# EAGLE design simpleSensor.-.v1.3 (EAGLE 5.11)
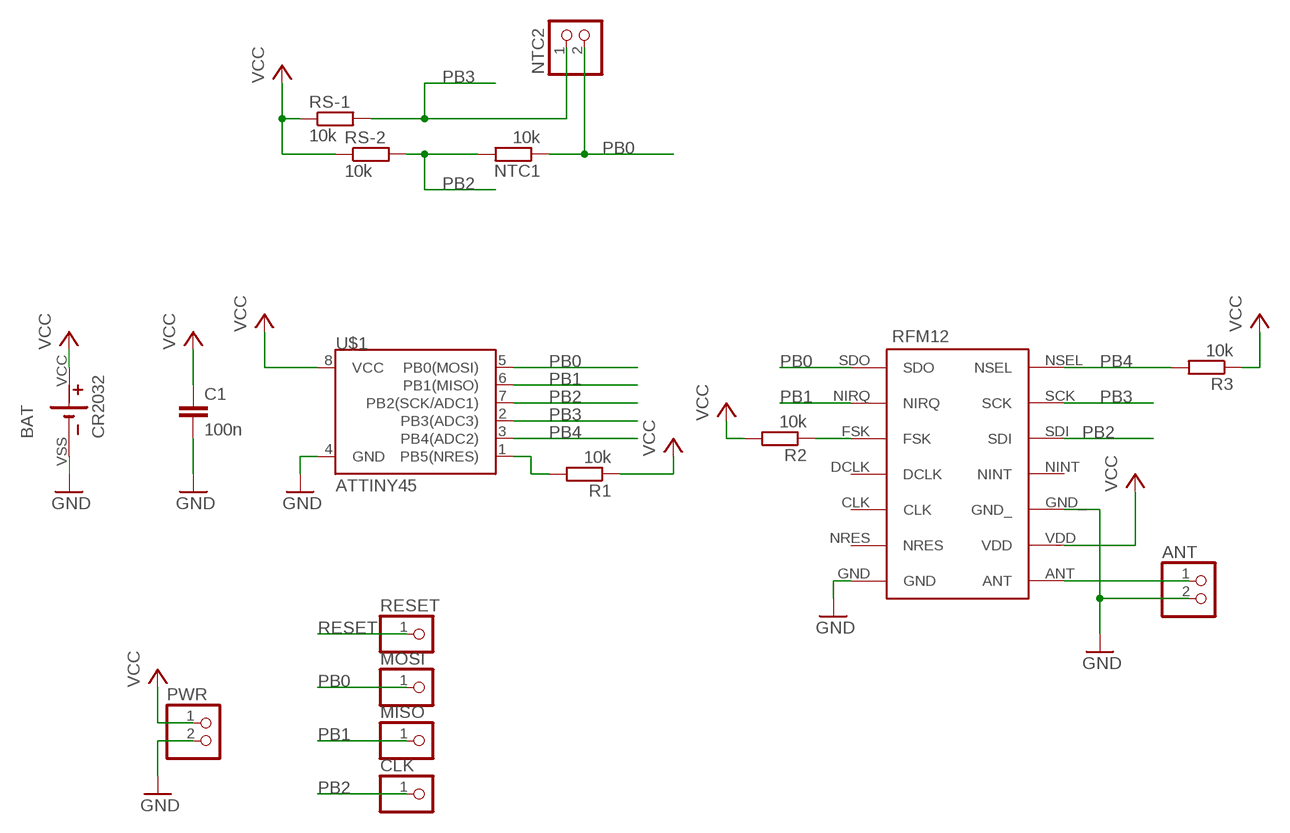
[diagram p0: schematic, sheet 1]

## Parts
ANT  PINHD-1X2  [1X02]
BAT  CR2032  BATTERYHOLDERCR2032_HORIZONTAL  [BATTERY_2032_HOR]
C1  100n  C-EUC0805  [C0805]
CLK  PINHD-1X1  [1X01]
MISO  PINHD-1X1  [1X01]
MOSI  PINHD-1X1  [1X01]
NTC1  10k  R-EU_R0805  [R0805]
NTC2  PINHD-1X2  [1X02]
PWR  PINHD-1X2  [1X02]
R1  10k  R-EU_R0805  [R0805]
R2  10k  R-EU_R0805  [R0805]
R3  10k  R-EU_R0805  [R0805]
RESET  PINHD-1X1  [1X01]
RFM12  RFM12SMD  [RFM_SMD]
RS-1  10k  R-EU_R0805  [R0805]
RS-2  10k  R-EU_R0805  [R0805]
U$1  ATTINY45  [SO08-EIAJ]

## Nets
ANT: ANT.1 RFM12.ANT
GND: ANT.2 BAT.VSS C1.2 PWR.2 RFM12.GND RFM12.GND_ U$1.4(GND)
N$4: R2.1 RFM12.FSK
PB0: MOSI.1 NTC1.1 NTC2.2 RFM12.SDO U$1.5(PB0(MOSI))
PB1: MISO.1 RFM12.NIRQ U$1.6(PB1(MISO))
PB2: CLK.1 NTC1.2 RFM12.SDI RS-2.2 U$1.7(PB2(SCK/ADC1))
PB3: NTC2.1 RFM12.SCK RS-1.2 U$1.2(PB3(ADC3))
PB4: R3.2 RFM12.NSEL U$1.3(PB4(ADC2))
RESET: R1.2 RESET.1 U$1.1(PB5(NRES))
VCC: BAT.VCC C1.1 PWR.1 R1.1 R2.2 R3.1 RFM12.VDD RS-1.1 RS-2.1 U$1.8(VCC)
Unconnected: RFM12.CLK RFM12.DCLK RFM12.NINT RFM12.NRES

## Library data of the parts
ANT NTC2 PWR = pinhead:PINHD-1X2: PIN HEADER
BAT = ppeter:BATTERYHOLDER
C1 = rcl:C-EU: CAPACITOR, European symbol
CLK MISO MOSI RESET = pinhead:PINHD-1X1: PIN HEADER
NTC1 R1-R3 RS-1 RS-2 = rcl:R-EU_: RESISTOR, European symbol
RFM12 = ppeter:RFM12: RFM12 Funk Modul
U$1 = SparkFun:ATTINY45: Atmel ATTiny45

## Board
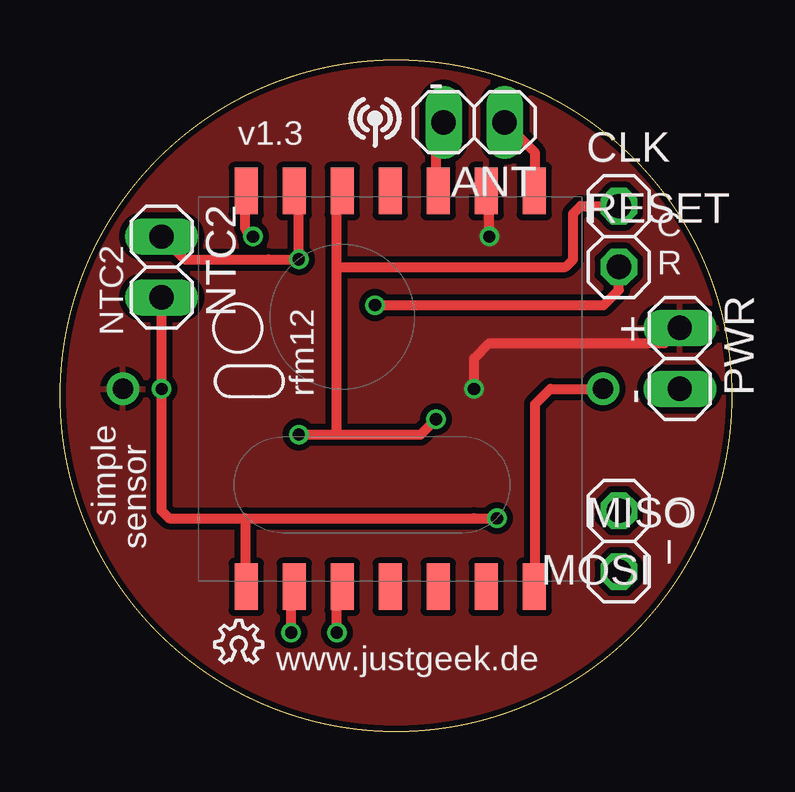
[diagram p1: board, top side]
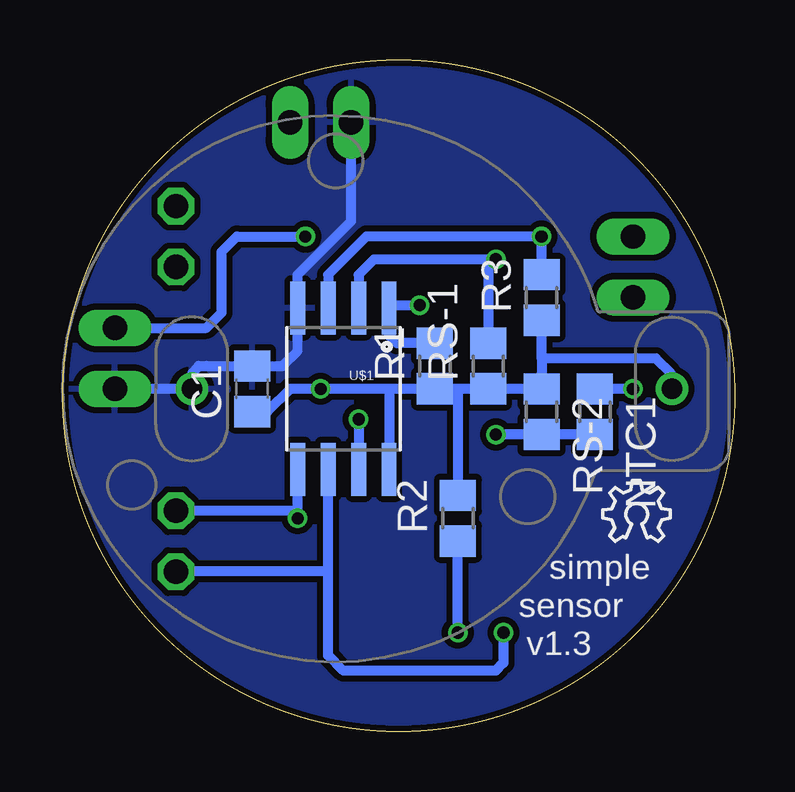
[diagram p2: board, bottom side, seen from below]

Size 28 x 28 mm. Coordinates in mm from the lower left corner, seen from the top.
Outline: circle at 14,14 radius 14
Copper layers (1*16): Top 0.035mm / dielectric 1.5mm / Bottom 0.035mm
Design rules "Fusion_eagle_rule_v1.1 *": minimum track width 6mil, minimum drill 12mil, track to track 6mil, track to pad 6mil, pad to pad 6mil, via to via 6mil, smd to smd 0mil, copper to edge 10mil, drill to drill 10mil, minimum pad ring 10mil, minimum via ring 6mil, stop-mask expansion 2mil, vias tented up to drill 100mil, thermal gap 10mil

### Footprints (pad centres in the part's own frame; a part is rotated, then mirrored left to right if it is on the bottom)
1X02 = drill 1.016 long: 1 -1.27,0; 2 1.27,0
BATTERY_2032_HOR = drill 0.85: VCC 0,-14; VSS 0,6
C0805 = smd 1.3 x 1.5: 1 -0.95,0; 2 0.95,0
1X01 = drill 1.016 octagon: 1 0,0
R0805 = smd 1.3 x 1.5: 1 -0.95,0; 2 0.95,0
RFM_SMD = smd 1.93 x 0.965: ANT 8.25,-6; CLK -8.25,-2; DCLK -8.25,0; FSK -8.25,2; GND -8.25,-6; GND_ 8.25,-2; NINT 8.25,0; NIRQ -8.25,4; NRES -8.25,-4; NSEL 8.25,6; SCK 8.25,4; SDI 8.25,2; SDO -8.25,6; VDD 8.25,-4
SO08-EIAJ = smd 0.61 x 2.21: 1 -1.905,-3.378; 2 -0.635,-3.378; 3 0.635,-3.378; 4 1.905,-3.378; 5 1.905,3.353; 6 0.635,3.353; 7 -0.635,3.353; 8 -1.905,3.353

### Placement (x,y rotation side)
ANT  17.25,25.4 180 top
BAT  16.62,14.29 90 bottom
C1  20.11,14.29 90 bottom
CLK  23.28,21.91 0 top
MISO  23.28,6.67 0 top
MOSI  23.28,9.21 180 top
NTC1  5.82,13.34 270 bottom
NTC2  4.24,19.37 270 top
PWR  25.83,15.56 270 top
R1  12.49,15.24 90 bottom
R2  11.54,8.89 90 bottom
R3  8.04,18.1 90 bottom
RESET  23.28,19.37 0 top
RFM12  13.76,14.29 90 top
RS-1  10.27,15.24 90 bottom
RS-2  8.04,13.34 270 bottom
U$1  16.3,14.29 180 bottom
U$2  [OSHW_6X70_NOTEXT]  6.46,2.86 0 top
U$3  [OSHW_6X100_NOTEXT]  5.5,7.94 0 bottom

### Tracks (layer width: path | path; a pad name or v marks a point on that pad's centre or on a via)
ANT
  Top 0.406: ANT.1 19.79,24.13 19.79,22.57 RFM12.ANT
GND
  Top 0.406: ANT.2 15.98,25.08 15.66,24.77 15.66,22.63 RFM12.GND_ | RFM12.GND 19.79,6.07 19.79,6.67 19.79,11.43 19.79,13.65 20.43,14.29 BAT.VSS 22.65,14.26 22.65,14.29
  Bottom 0.406: 15.98,21.91 15.98,21.27 17.57,19.68 18.21,19.05 U$1.4 18.21,15.88 18.84,15.24 C1.2 22.01,15.24 22.33,15.24 22.62,14.92 BAT.VSS 22.65,14.29 PWR.2 | 15.98,21.91 15.98,22.23 | 15.98,22.23 ANT.2 | 15.98,21.91 15.98,22.23
  pour Bottom (isolate 0.254): 0.11,0 0.11,28.26 28.37,28.26 28.37,0
N$4  (via drill 0.51)
  Top 0.406: v11.54,4.13 11.54,5.82 RFM12.FSK
  Bottom 0.406: v11.54,4.13 R2.1 | R2.1 | R2.1 | R2.1 | R2.1 | R2.1
PB0  (via drill 0.51)
  Top 0.406: NTC2.2 4.24,17.78 v4.24,14.29 4.24,9.21 4.55,8.89 7.73,8.89 | v18.21,8.89 17.25,8.89 7.73,8.89 | RFM12.SDO 7.73,6.07 7.73,8.89
  Bottom 0.406: NTC1.1 4.55,14.29 v4.24,14.29 | U$1.5 18.21,10.16 18.21,9.21 | 18.21,9.21 MOSI.1 | v18.21,8.89 18.21,9.21
PB1  (via drill 0.51)
  Top 0.406: v9.63,4.13 9.63,5.91 RFM12.NIRQ
  Bottom 0.406: 16.94,6.67 MISO.1 | 16.94,6.67 16.94,7.3 | 16.94,7.3 16.94,10.79 | 16.94,10.79 U$1.6 16.94,10.79 | 16.94,7.3 16.94,10.79 | 16.94,6.67 16.94,3.17 16.3,2.54 9.95,2.54 9.63,2.86 v9.63,4.13 | 16.94,6.67 16.94,7.3
PB2  (via drill 0.51)
  Top 0.406: v9.95,12.38 11.54,12.38 | 11.54,12.38 15.03,12.38 v15.66,13.02 | 11.54,19.37 21.06,19.37 21.38,19.68 21.38,21.59 21.7,21.91 CLK.1 | 11.54,12.38 11.54,19.37 | 11.54,19.37 11.54,22.44 RFM12.SDI
  Bottom 0.406: NTC1.2 RS-2.2 v9.95,12.38 | v15.66,13.02 U$1.7
PB3  (via drill 0.51)
  Top 0.406: RFM12.SCK 9.63,22.35 9.83,22.35 9.95,22.23 v9.95,19.68 8.68,19.68 5.19,19.68 NTC2.1
  Bottom 0.406: 10.27,19.68 RS-1.2 | 10.27,19.68 v9.95,19.68 10.27,19.68 | 10.27,19.68 15.03,19.68 15.66,19.05 U$1.2
PB4  (via drill 0.51)
  Top 0.406: 7.76,22.51 RFM12.NSEL 7.73,22.5 7.73,20.95 v8.05,20.64
  Bottom 0.406: U$1.3 16.94,19.05 15.66,20.32 15.35,20.64 v8.05,20.64 8.05,20.32 R3.2
RESET  (via drill 0.51)
  Top 0.406: RESET.1 23.28,18.41 22.65,17.78 v13.13,17.78
  Bottom 0.406: R1.2 14.07,16.19 14.39,16.51 U$1.1 14.28,17.78 v13.13,17.78
VCC  (via drill 0.51)
  Top 0.406: v17.89,20.64 17.89,22.41 RFM12.VDD | v17.25,14.29 17.25,15.56 17.89,16.19 25.19,16.19 PWR.1
  Bottom 0.406: 11.54,14.29 RS-1.1 9,14.29 RS-2.1 8.05,14.92 8.05,15.56 | 11.54,14.29 R1.1 14.39,14.29 | 14.39,14.29 14.4,14.29 15.35,14.29 v17.25,14.29 18.52,14.29 19.47,13.34 C1.1 | 14.39,14.29 U$1.8 | 2.65,14.29 BAT.VCC 2.65,14.32 2.65,14.92 3.28,15.56 8.05,15.56 | 11.54,14.29 R2.2 | 8.05,15.56 8.05,16.51 R3.1 | v17.89,20.64 20.74,20.64 21.38,20 21.38,17.46 22.01,16.83 PWR.1
  pour Top (isolate 0.254): 0.11,0 0.11,28.26 28.37,28.26 28.37,0

### Text on the board
tPlace: - | v1.3 | C | R | NTC2 | + | rfm12 | - | simple | O | sensor | I | www.justgeek.de
bPlace: simple | sensor | v1.3